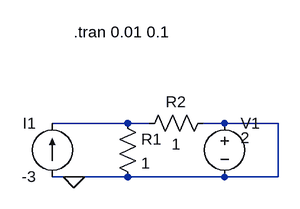
[diagram p0: schematic Draft32.asc]
Draft32.asc, the LTspice schematic file:
Version 4
SHEET 1 880 680
WIRE 240 336 128 336
WIRE 272 336 240 336
WIRE 384 336 352 336
WIRE 464 336 384 336
WIRE 160 416 128 416
WIRE 240 416 160 416
WIRE 384 416 240 416
WIRE 464 416 464 336
WIRE 464 416 384 416
FLAG 160 416 0
SYMBOL current 128 416 R180
WINDOW 0 24 80 Left 2
WINDOW 3 24 0 Left 2
SYMATTR InstName I1
SYMATTR Value -3
SYMBOL voltage 384 320 R0
WINDOW 3 24 38 Left 2
SYMATTR InstName V1
SYMATTR Value 2
SYMBOL res 224 320 R0
SYMATTR InstName R1
SYMATTR Value 1
SYMBOL res 368 320 R90
WINDOW 0 0 56 VBottom 2
WINDOW 3 32 56 VTop 2
SYMATTR InstName R2
SYMATTR Value 1
TEXT 160 200 Left 2 !.tran 0.01 0.1

The netlist it stands for:
* Draft32.asc
I1 0 N001 -3
V1 0 0 2
R1 N001 0 1
R2 0 N001 1
.tran 0.01 0.1
.backanno
.end